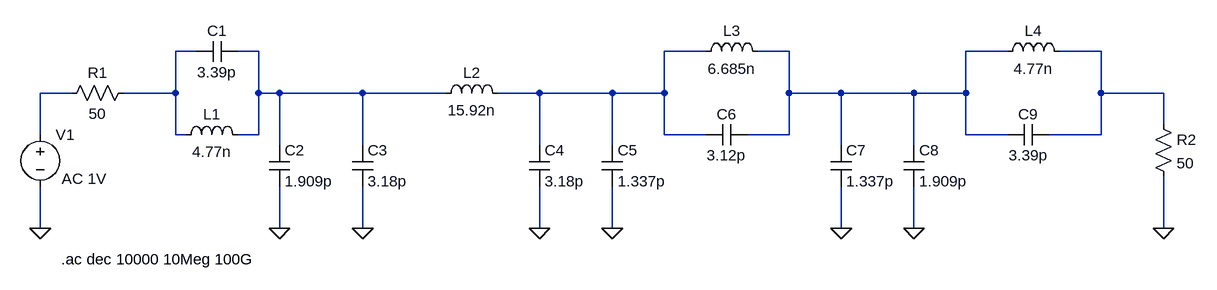
[diagram p0: schematic Ex3.asc]
Ex3.asc, the LTspice schematic file:
Version 4
SHEET 1 1736 680
WIRE 192 16 160 16
WIRE 288 16 256 16
WIRE 976 16 912 16
WIRE 1104 16 1056 16
WIRE 1440 16 1376 16
WIRE 1584 16 1520 16
WIRE 0 80 -48 80
WIRE 160 80 160 16
WIRE 160 80 80 80
WIRE 288 80 288 16
WIRE 320 80 288 80
WIRE 448 80 320 80
WIRE 576 80 448 80
WIRE 720 80 656 80
WIRE 832 80 720 80
WIRE 912 80 912 16
WIRE 912 80 832 80
WIRE 1104 80 1104 16
WIRE 1184 80 1104 80
WIRE 1296 80 1184 80
WIRE 1376 80 1376 16
WIRE 1376 80 1296 80
WIRE 1584 80 1584 16
WIRE 1680 80 1584 80
WIRE 1680 128 1680 80
WIRE -48 144 -48 80
WIRE 160 144 160 80
WIRE 176 144 160 144
WIRE 288 144 288 80
WIRE 288 144 256 144
WIRE 912 144 912 80
WIRE 976 144 912 144
WIRE 1104 144 1104 80
WIRE 1104 144 1040 144
WIRE 1376 144 1376 80
WIRE 1440 144 1376 144
WIRE 1584 144 1584 80
WIRE 1584 144 1504 144
WIRE 320 160 320 80
WIRE 448 160 448 80
WIRE 720 160 720 80
WIRE 832 160 832 80
WIRE 1184 160 1184 80
WIRE 1296 160 1296 80
WIRE -48 288 -48 224
WIRE 320 288 320 224
WIRE 448 288 448 224
WIRE 720 288 720 224
WIRE 832 288 832 224
WIRE 1184 288 1184 224
WIRE 1296 288 1296 224
WIRE 1680 288 1680 208
FLAG -48 288 0
FLAG 320 288 0
FLAG 448 288 0
FLAG 720 288 0
FLAG 832 288 0
FLAG 1184 288 0
FLAG 1296 288 0
FLAG 1680 288 0
SYMBOL res 96 64 R90
WINDOW 0 0 56 VBottom 2
WINDOW 3 32 56 VTop 2
SYMATTR InstName R1
SYMATTR Value 50
SYMBOL cap 256 0 R90
WINDOW 0 0 32 VBottom 2
WINDOW 3 32 32 VTop 2
SYMATTR InstName C1
SYMATTR Value 3.39p
SYMBOL ind 160 160 R270
WINDOW 0 32 56 VTop 2
WINDOW 3 5 56 VBottom 2
SYMATTR InstName L1
SYMATTR Value 4.77n
SYMBOL voltage -48 128 R0
WINDOW 123 33 84 Left 2
WINDOW 39 0 0 Left 0
SYMATTR InstName V1
SYMATTR Value ""
SYMATTR Value2 AC 1V
SYMBOL cap 304 160 R0
SYMATTR InstName C2
SYMATTR Value 1.909p
SYMBOL cap 432 160 R0
SYMATTR InstName C3
SYMATTR Value 3.18p
SYMBOL ind 560 96 R270
WINDOW 0 32 56 VTop 2
WINDOW 3 5 56 VBottom 2
SYMATTR InstName L2
SYMATTR Value 15.92n
SYMBOL cap 704 160 R0
SYMATTR InstName C4
SYMATTR Value 3.18p
SYMBOL cap 816 160 R0
SYMATTR InstName C5
SYMATTR Value 1.337p
SYMBOL ind 960 32 R270
WINDOW 0 32 56 VTop 2
WINDOW 3 5 56 VBottom 2
SYMATTR InstName L3
SYMATTR Value 6.685n
SYMBOL cap 1040 128 R90
WINDOW 0 0 32 VBottom 2
WINDOW 3 32 32 VTop 2
SYMATTR InstName C6
SYMATTR Value 3.12p
SYMBOL cap 1168 160 R0
SYMATTR InstName C7
SYMATTR Value 1.337p
SYMBOL cap 1280 160 R0
SYMATTR InstName C8
SYMATTR Value 1.909p
SYMBOL ind 1424 32 R270
WINDOW 0 32 56 VTop 2
WINDOW 3 5 56 VBottom 2
SYMATTR InstName L4
SYMATTR Value 4.77n
SYMBOL cap 1504 128 R90
WINDOW 0 0 32 VBottom 2
WINDOW 3 32 32 VTop 2
SYMATTR InstName C9
SYMATTR Value 3.39p
SYMBOL res 1664 112 R0
SYMATTR InstName R2
SYMATTR Value 50
TEXT -16 336 Left 2 !.ac dec 10000 10Meg 100G

The netlist it stands for:
* Ex3.asc
R1 N001 N006 50
C1 N002 N001 3.39p
L1 N001 N002 4.77n
V1 N006 0 AC 1V
C2 N002 0 1.909p
C3 N002 0 3.18p
L2 N002 N003 15.92n
C4 N003 0 3.18p
C5 N003 0 1.337p
L3 N003 N004 6.685n
C6 N004 N003 3.12p
C7 N004 0 1.337p
C8 N004 0 1.909p
L4 N004 N005 4.77n
C9 N005 N004 3.39p
R2 N005 0 50
.ac dec 10000 10Meg 100G
.backanno
.end